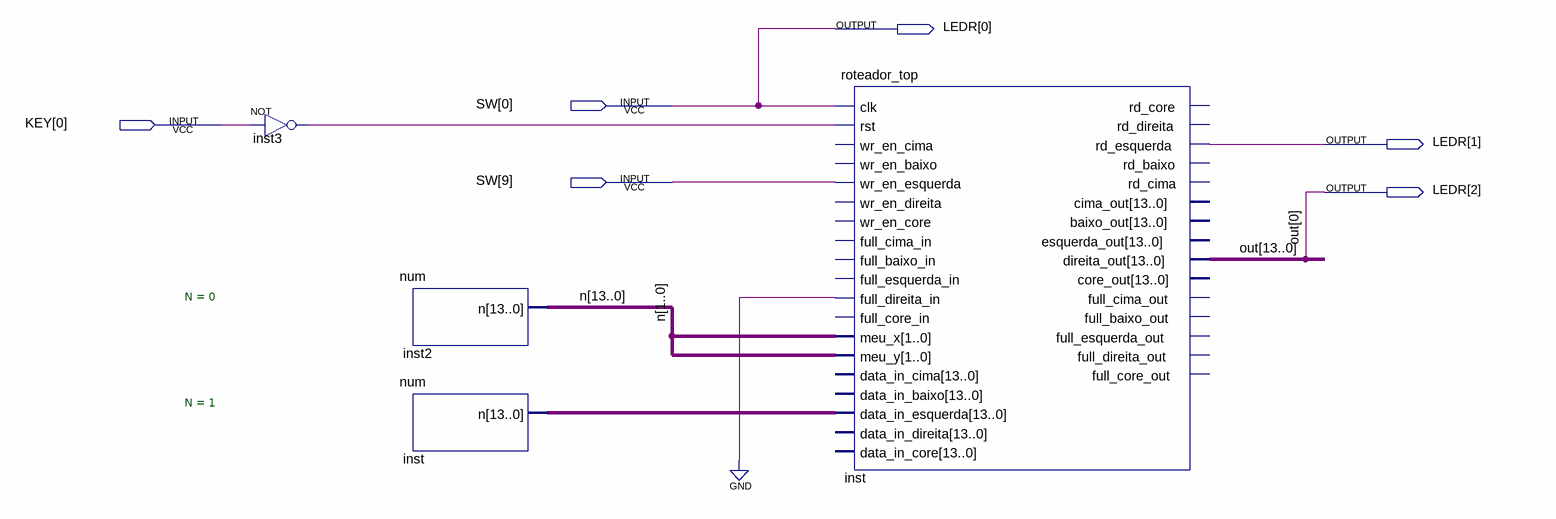
[diagram p0: schematic sheet]
// Quartus schematic teste_roteador_jesus.bdf as structural Verilog: 4 symbols, 6 pins
module teste_roteador_jesus (
  input  [9:0] SW,
  input  [0:0] KEY,
  output [2:0] LEDR
);

  wire inst3_out;
  wire [13:0] inst_n, n;
  wire [13:1] out;

  not inst3 (inst3_out, KEY[0]);
  num #(.N(0)) inst2 (.n(n));
  num #(.N(1)) inst (.n(inst_n));
  roteador_top inst_dup2 (
    .clk(SW[0]), .rst(inst3_out), .wr_en_esquerda(SW[9]), .full_direita_in(1'b0), .meu_x(n[1:0]),
    .meu_y(n[1:0]), .data_in_esquerda(inst_n), .rd_esquerda(LEDR[1]), .direita_out({out, LEDR[2]}));  // open: wr_en_cima, wr_en_baixo, wr_en_direita, wr_en_core, full_cima_in, full_baixo_in, full_esquerda_in, full_core_in, data_in_cima, data_in_baixo, data_in_direita, data_in_core, rd_core, rd_direita, rd_baixo, rd_cima, cima_out, baixo_out, esquerda_out, core_out, full_cima_out, full_baixo_out, full_esquerda_out, full_direita_out, full_core_out

  assign LEDR[0] = SW[0];

  // Other names for the same wires on the sheet: out[0] = LEDR[2]
endmodule
